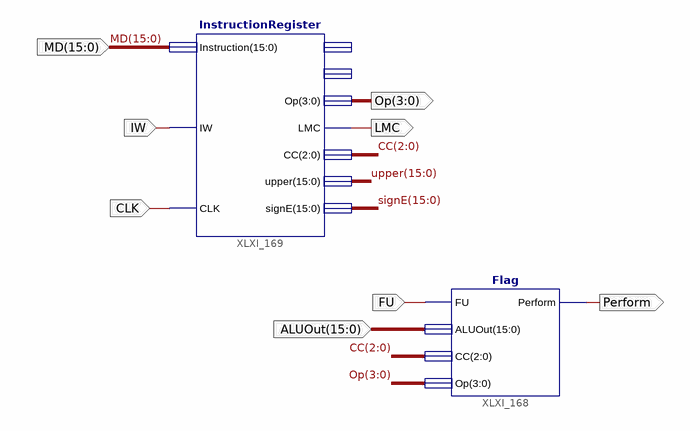
[diagram p0: schematic sheet 1]
// Xilinx ISE schematic IntegratedTestIR_Flag.sch (spartan3e) as structural Verilog: 2 symbols, 8 ports
module IntegratedTestIR_Flag (
  input  FU,
  input  CLK,
  input  IW,
  input  [15:0] MD,
  input  [15:0] ALUOut,
  output Perform,
  output [3:0] Op,
  output LMC
);

  wire [2:0] CC;
  wire [15:0] signE, upper;

  Flag XLXI_168 (.FU(FU), .ALUOut(ALUOut), .CC(CC), .Op(Op), .Perform(Perform));
  InstructionRegister XLXI_169 (
    .IW(IW), .CLK(CLK), .Instruction(MD), .signE(signE), .CC(CC), .upper(upper), .LMC(LMC), .Op(Op));  // open: r1, r2
endmodule
